# Altium schematic sheet v3.SchDoc: Open Helm V3
size A4; DrawnBy: Jetsada Machom
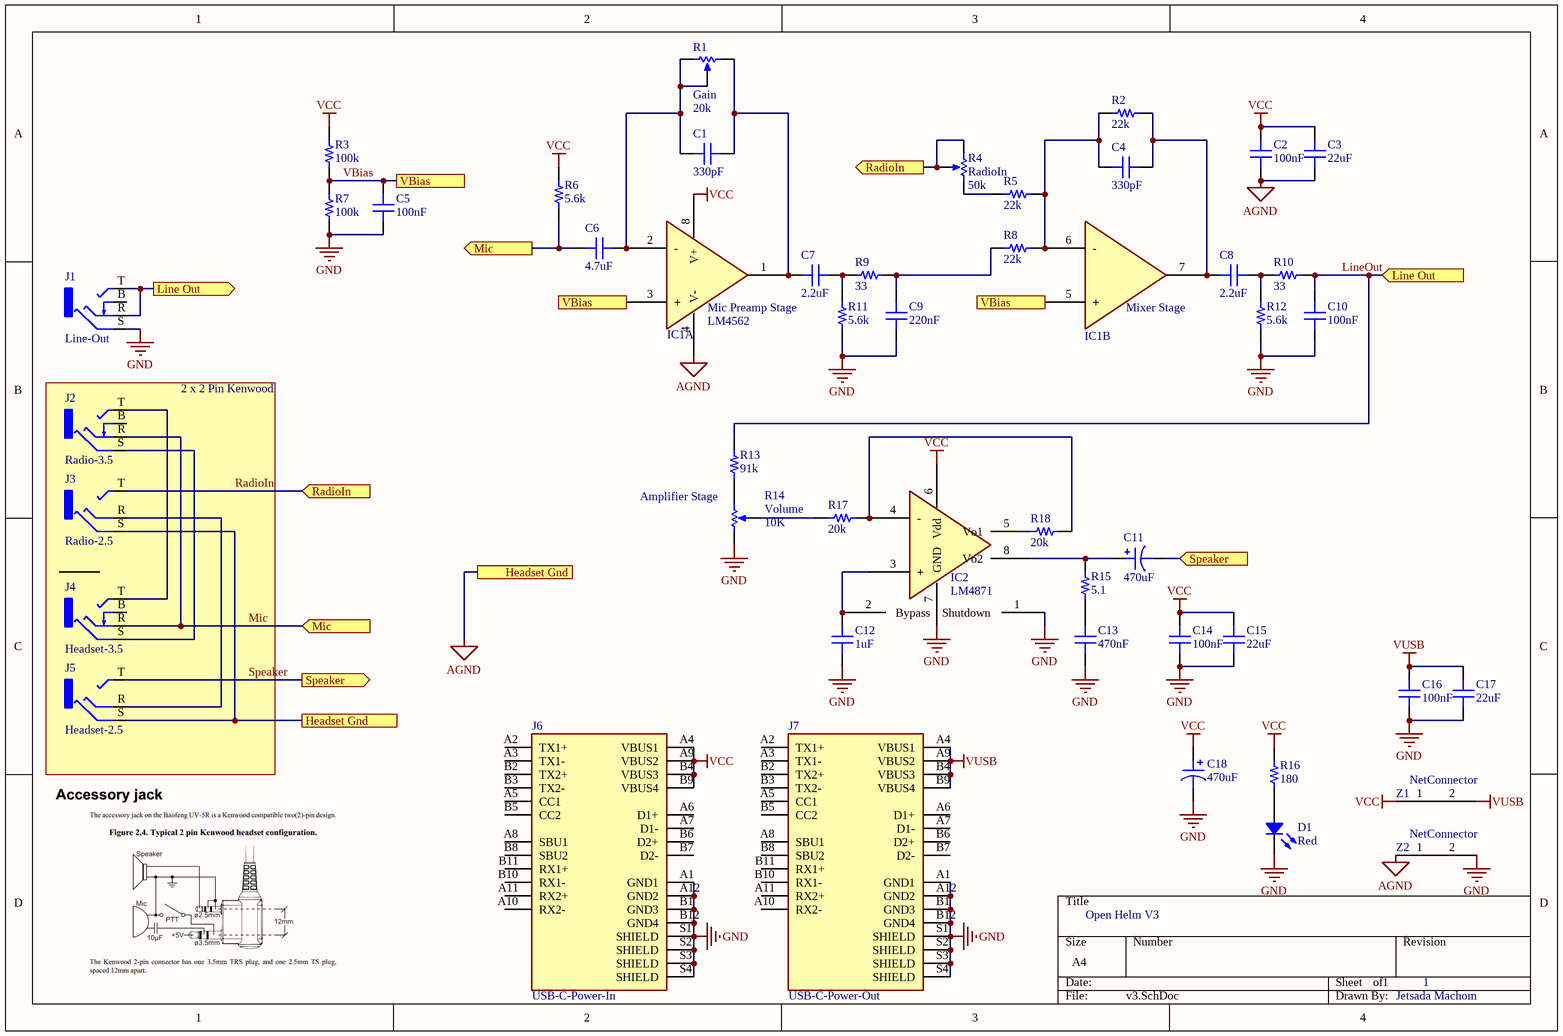
[diagram p0: v3.SchDoc]

## Parts
C1  330pF  [CAP 0805_2012]
C2  100nF  [CAP 0805_2012]
C3  22uF  [CAP 0805_2012]
C4  330pF  [CAP 0805_2012]
C5  100nF  [CAP 0805_2012]
C6  4.7uF  [CAP 0805_2012]
C7  2.2uF  [CAP 0805_2012]
C8  2.2uF  [CAP 0805_2012]
C9  220nF  [CAP 0805_2012]
C10  100nF  [CAP 0805_2012]
C11  470uF  [EEEFT-D8]
C12  1uF  [CAP 0805_2012]
C13  470nF  [CAP 0805_2012]
C14  100nF  [CAP 0805_2012]
C15  22uF  [CAP 0805_2012]
C16  100nF  [CAP 0805_2012]
C17  22uF  [CAP 0805_2012]
C18  470uF  [EEEFT-D8]
D1  Red  [LED 0805_2012 RED]
IC1  LM4562  [LM4562]  (parts A,B of 2)
IC2  LM4871  [LM4871]
J1  Line-Out  [KLBR4]
J2  Radio-3.5  [KLBR4]
J3  Radio-2.5  [LUMBERG150105]
J4  Headset-3.5  [KLBR4]
J5  Headset-2.5  [LUMBERG150105]
J6  USB-C-Power-In  [MC001002]
J7  USB-C-Power-Out  [MC001002]
R1  Gain  value 20k  [3224W]
R2  22k  [RES 0805_2012]
R3  100k  [RES 0805_2012]
R4  RadioIn  value 50k  [3224W]
R5  22k  [RES 0805_2012]
R6  5.6k  [RES 0805_2012]
R7  100k  [RES 0805_2012]
R8  22k  [RES 0805_2012]
R9  33  [RES 0805_2012]
R10  33  [RES 0805_2012]
R11  5.6k  [RES 0805_2012]
R12  5.6k  [RES 0805_2012]
R13  91k  [RES 0805_2012]
R14  Volume  value 10K  [RK09]
R15  5.1  [RES 0805_2012]
R16  180  [RES 0805_2012]
R17  20k  [RES 0805_2012]
R18  20k  [RES 0805_2012]
Z1  NetConnector  [NetConnector]
Z2  NetConnector  [NetConnector]

## Blocks framed on the sheet
2 x 2 Pin Kenwood: J2-J5

## Ports
Headset Gnd, Line Out (in), Line Out (out), Mic (in), Mic (out), RadioIn (in), RadioIn (out), Speaker (in), Speaker (out), VBias

## Nets
AGND: C2.1 C3.1 IC1.4(V-) J3.S J5.S Z2.1 ; port Headset Gnd
GND: C5.1 C9.1 C10.1 C12.1 C13.1 C14.1 C15.1 C16.1 C17.1 C18.2 D1.2 IC2.1(Shutdown) IC2.7(GND) J1.S J6.A1(GND1) J6.A12(GND2) J6.B1(GND3) J6.B12(GND4) J6.S1(SHIELD) J6.S2(SHIELD) J6.S3(SHIELD) J6.S4(SHIELD) J7.A1(GND1) J7.A12(GND2) J7.B1(GND3) J7.B12(GND4) J7.S1(SHIELD) J7.S2(SHIELD) J7.S3(SHIELD) J7.S4(SHIELD) R7.1 R11.1 R12.1 R14.1(TOP) Z2.2
VCC: C2.2 C3.2 C14.2 C15.2 C18.1 IC1.8(V+) IC2.6(Vdd) J6.A4(VBUS1) J6.A9(VBUS2) J6.B4(VBUS3) J6.B9(VBUS4) R3.2 R6.2 R16.2 Z1.1
VUSB: C16.2 C17.2 J7.A4(VBUS1) J7.A9(VBUS2) J7.B4(VBUS3) J7.B9(VBUS4) Z1.2
LineOut: C10.2 J1.R J1.T R10.1 R13.1 ; port Line Out
Mic: C6.1 J2.R J4.R R6.1 ; port Mic
RadioIn: J3.T R4.1(TOP) R4.2(TAP) ; port RadioIn
Speaker: C11.2 J5.T ; port Speaker
VBias: C5.2 IC1.3(+) IC1.5(+) R3.1 R7.2 ; port VBias
NetC1_1: C1.1 C6.2 IC1.2(-) R1.1(TOP) R1.2(TAP)
NetC1_2: C1.2 C7.1 IC1.1(OUT) R1.3(BOT)
NetC4_1: C4.1 IC1.6(-) R2.2 R5.1 R8.1
NetC4_2: C4.2 C8.1 IC1.7(OUT) R2.1
NetC7_2: C7.2 R9.2 R11.2
NetC8_2: C8.2 R10.2 R12.2
NetC9_2: C9.2 R8.2 R9.1
NetC11_1: C11.1 IC2.8(Vo2) R15.1
NetC12_2: C12.2 IC2.2(Bypass) IC2.3(+)
NetC13_2: C13.2 R15.2
NetD1_1: D1.1 R16.1
NetIC2_4: IC2.4(-) R17.2 R18.2
NetIC2_5: IC2.5(Vo1) R18.1
NetJ2_S: J2.S J4.S
NetJ2_T: J2.T J4.T
NetJ3_R: J3.R J5.R
NetR4_3: R4.3(BOT) R5.2
NetR13_2: R13.2 R14.3(BOT)
NetR14_2: R14.2(TAP) R17.1

Not connected (* = marked no-connect by the designer): J1 B; J2 B; J4 B; J6 A2(TX1+) A3(TX1-) A5(CC1) A6(D1+) A7(D1-) A8(SBU1) A10(RX2-) A11(RX2+) B2(TX2+) B3(TX2-) B5(CC2) B6(D2+) B7(D2-) B8(SBU2) B10(RX1-) B11(RX1+); J7 A2(TX1+) A3(TX1-) A5(CC1) A6(D1+) A7(D1-) A8(SBU1) A10(RX2-) A11(RX2+) B2(TX2+) B3(TX2-) B5(CC2) B6(D2+) B7(D2-) B8(SBU2) B10(RX1-) B11(RX1+)

## Notes on the sheet
- (near IC1) Mic Preamp Stage
- (near IC1) Mixer Stage
- (near R14) Amplifier Stage
- 1

## Library data of the parts
C1 C4 = C0805C565K9PACTU: Multilayer Ceramic Capacitors MLCC - SMD/SMT 330pF 50V 0805 RoHS; Value: 330pF; ComponentLink1Description: Datasheet; ComponentLink1URL: https://api.kemet.com/component-edge/download/datasheet/C0805C565K9PACTU.pdf; ComponentLink2Description: DigiKey Link; ComponentLink2URL: http://digikey.com/product-detail/en/kemet/C0805C565K9PACTU/399-3135-1-ND/551640; Device Package: 0805 (2012 Metric); Package / Case: 0805 (2012 Metric); Voltage - Rated: 50V; Supplier 1: LCSC; Supplier Part Number 1: C51207
C2 C5 C10 C12 C14 C16 = C0805C565K9PACTU: Multilayer Ceramic Capacitors MLCC - SMD/SMT 100nF 50V 0805 RoHS; ComponentLink1Description: Datasheet; ComponentLink1URL: https://api.kemet.com/component-edge/download/datasheet/C0805C565K9PACTU.pdf; ComponentLink2Description: DigiKey Link; ComponentLink2URL: http://digikey.com/product-detail/en/kemet/C0805C565K9PACTU/399-3135-1-ND/551640; Device Package: 0805 (2012 Metric); Package / Case: 0805 (2012 Metric); Voltage - Rated: 50V; Supplier 1: LCSC
  C2 C5 C10 C14 C16: Value: 100nF; Supplier Part Number 1: C49678
  C12: Value: 1uF; Supplier Part Number 1: C28323
C3 C15 C17 = C0805C565K9PACTU: Multilayer Ceramic Capacitors MLCC - SMD/SMT 22uF 25V 0805 RoHS; Value: 22uF; ComponentLink1Description: Datasheet; ComponentLink1URL: https://api.kemet.com/component-edge/download/datasheet/C0805C565K9PACTU.pdf; ComponentLink2Description: DigiKey Link; ComponentLink2URL: http://digikey.com/product-detail/en/kemet/C0805C565K9PACTU/399-3135-1-ND/551640; Device Package: 0805 (2012 Metric); Package / Case: 0805 (2012 Metric); Voltage - Rated: 25V; Supplier 1: LCSC; Supplier Part Number 1: C45783
C6 = C0805C565K9PACTU: Multilayer Ceramic Capacitors MLCC - SMD/SMT 4.7uF 25V 0805 RoHS; Value: 4.7uF; Device Package: 0805 (2012 Metric); Package / Case: 0805 (2012 Metric); Voltage - Rated: 25V; Supplier 1: LCSC; Supplier Part Number 1: C1779
C7 C8 = C0805C565K9PACTU: Multilayer Ceramic Capacitors MLCC - SMD/SMT 2.2uF 50V 0805 RoHS; Value: 2.2uF; ComponentLink1Description: Datasheet; ComponentLink1URL: https://api.kemet.com/component-edge/download/datasheet/C0805C565K9PACTU.pdf; ComponentLink2Description: DigiKey Link; ComponentLink2URL: http://digikey.com/product-detail/en/kemet/C0805C565K9PACTU/399-3135-1-ND/551640; Device Package: 0805 (2012 Metric); Package / Case: 0805 (2012 Metric); Voltage - Rated: 50V; Supplier 1: LCSC; Supplier Part Number 1: C49217
C9 = C0805C565K9PACTU: Multilayer Ceramic Capacitors MLCC - SMD/SMT 220nF 50V 0805 RoHS; Value: 220nF; ComponentLink1Description: Datasheet; ComponentLink1URL: https://api.kemet.com/component-edge/download/datasheet/C0805C565K9PACTU.pdf; ComponentLink2Description: DigiKey Link; ComponentLink2URL: http://digikey.com/product-detail/en/kemet/C0805C565K9PACTU/399-3135-1-ND/551640; Device Package: 0805 (2012 Metric); Package / Case: 0805 (2012 Metric); Voltage - Rated: 50V; Supplier 1: LCSC; Supplier Part Number 1: C5378
C11 = 6TCE150M: SMD Aluminium Electrolytic Capacitor, Radial Can - SMD, 470 µF, 6.3 V, 0.16 ohm, FT Series; Voltage - Rated: 6.3V; Value: 470uF; Supplier 1: Farnell; Supplier Part Number 1: 2065955
C13 = C0805C565K9PACTU: Multilayer Ceramic Capacitors MLCC - SMD/SMT 470nF 50V 0805 RoHS; Value: 470nF; Device Package: 0805 (2012 Metric); Package / Case: 0805 (2012 Metric); Voltage - Rated: 50V; Supplier 1: LCSC; Supplier Part Number 1: C13967
C18 = 6TCE150M: SMD Aluminium Electrolytic Capacitor, Radial Can - SMD, 470 µF, 10 V, 0.16 ohm, FT Series; Voltage - Rated: 10V; Value: 470uF; Supplier 1: Farnell; Supplier Part Number 1: 2065963
D1 = APT2012SURCK: LIGHT EMITTING DIODES (LED) RED 615~630NM 67~195MCD@20MA TOP VIEW 0805 ROHS; Color: Red; Device Package: 0805 (2012 Metric); Package / Case: 0805 (2012 Metric); Supplier 1: LCSC; Supplier Part Number 1: C84256
IC1 = LM4562: Audio Power Amplifier, 2 Channel, ± 2.5V to ± 17V, SOIC, 8 Pins; Supplier 1: Farnell; Supplier Part Number 1: 3004534
IC2 = LM4871: Audio Power Amplifier, 3 W, AB, 1 Channel, 2V to 5.5V, SOIC, 8 Pins; Supplier 1: Farnell; Supplier Part Number 1: 3116874
J1 J2 J4 = KLBR4: Phone Audio Connector, 3 Contacts, Socket, 3.5 mm, PCB Mount, Silver Plated Contacts, Metal Body; Supplier 1: Farnell; Supplier Part Number 1: 1217016
J3 J5 = LUMBERG150105: Phone Audio Connector, 3 Contacts, Socket, 2.5 mm, PCB Mount, Silver Plated Contacts, Metal Body; Supplier 1: Farnell; Supplier Part Number 1: 1216978
J6 J7 = USBC: USB Connector, USB Type C, USB 3.1, Receptacle, 24 Ways, Surface Mount, Through Hole Mount; Supplier 1: Farnell; Supplier Part Number 1: 2498948
R1 = RPot: 20K ±10% ±100ppm/°C Variable Resistors; Supplier 1: Farnell; Supplier Part Number 1: 514998
R2 R5 R8 = TLRZ2ATTD: Chip Resistor - Surface Mount 22KOhms ±1% 1/8W 0805 RoHS; Value: 22k; Device Package: 0805 (2012 Metric); Package / Case: 0805 (2012 Metric); Supplier 1: LCSC; Supplier Part Number 1: C17560
R3 R7 = TLRZ2ATTD: Chip Resistor - Surface Mount 100KOhms ±1% 1/8W 0805 RoHS; Value: 100k; Device Package: 0805 (2012 Metric); Package / Case: 0805 (2012 Metric); Supplier 1: LCSC; Supplier Part Number 1: C17407
R4 = RPot: 50K ±10% ±100ppm/°C Variable Resistors; Supplier 1: Farnell; Supplier Part Number 1: 1612575
R6 R11 R12 = TLRZ2ATTD: Chip Resistor - Surface Mount 5.6KOhms ±1% 1/8W 0805 RoHS; Value: 5.6k; Device Package: 0805 (2012 Metric); Package / Case: 0805 (2012 Metric); Supplier 1: LCSC; Supplier Part Number 1: C4382
R9 R10 = TLRZ2ATTD: Chip Resistor - Surface Mount 33Ohms ±1% 1/8W 0805 RoHS; Value: 33; Device Package: 0805 (2012 Metric); Package / Case: 0805 (2012 Metric); Supplier 1: LCSC; Supplier Part Number 1: C17634
R13 = TLRZ2ATTD: Chip Resistor - Surface Mount 91KOhms ±1% 1/8W 0805 RoHS; Value: 91k; Device Package: 0805 (2012 Metric); Package / Case: 0805 (2012 Metric); Supplier 1: LCSC; Supplier Part Number 1: C17866
R14 = RPot: Rotary Potentiometer, 10 kohm, 1 Turns, Logarithmic, 50 mW, ± 20%, RK09 Series; Supplier 1: Farnell; Supplier Part Number 1: 1191724
R15 = TLRZ2ATTD: Chip Resistor - Surface Mount 5.1Ohms ±1% 1/8W 0805 RoHS; Value: 5.1; Device Package: 0805 (2012 Metric); Package / Case: 0805 (2012 Metric); Supplier 1: LCSC; Supplier Part Number 1: C17724
R16 = RG2012P-275-B-T5: Chip Resistor - Surface Mount 180Ohms ±1% 1/8W 0805 RoHS; Value: 180; ComponentLink1Description: Datasheet; ComponentLink1URL: http://www.susumu.co.jp/common/pdf/n_catalog_partition01_en.pdf; ComponentLink2Description: DigiKey Link; ComponentLink2URL: http://digikey.com/product-detail/en/susumu/RG2012P-275-B-T5/408-2028-1-ND/7035411; Device Package: 0805 (2012 Metric); Package / Case: 0805 (2012 Metric); Supplier 1: LCSC; Supplier Part Number 1: C25270
R17 R18 = TLRZ2ATTD: Chip Resistor - Surface Mount 20KOhms ±1% 1/8W 0805 RoHS; Value: 20k; Device Package: 0805 (2012 Metric); Package / Case: 0805 (2012 Metric); Supplier 1: LCSC; Supplier Part Number 1: C4328